# Altium schematic sheet 18_IR_LED.SchDoc
size 420 x 297 mm; SheetNumber: 18; SheetTotal: 27
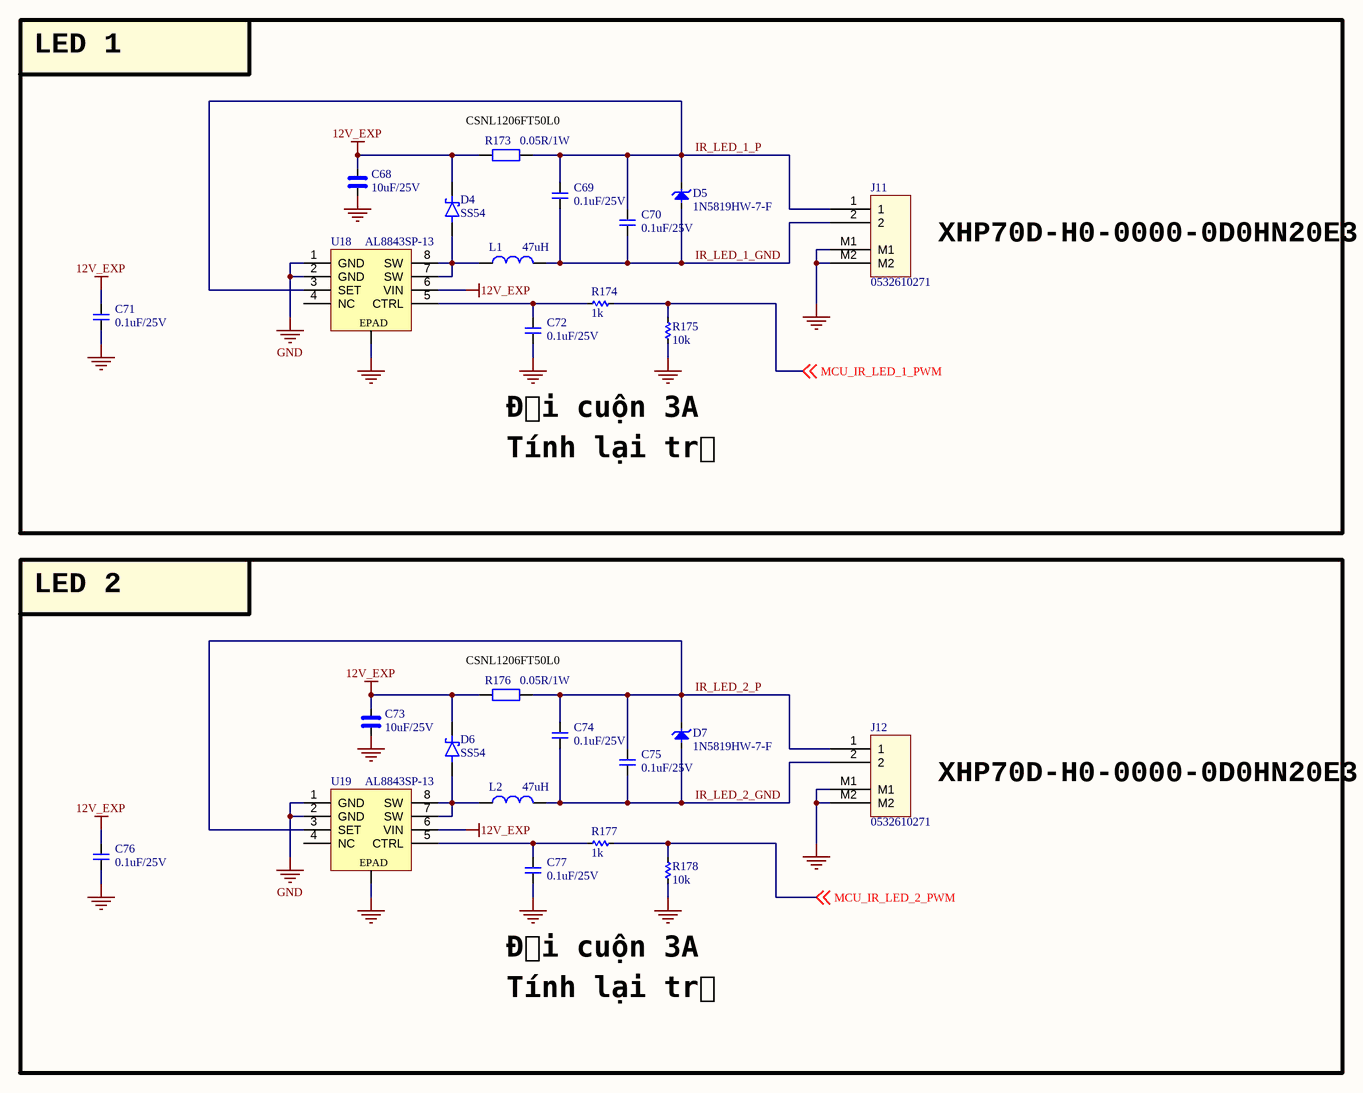
[diagram p0: 18_IR_LED.SchDoc]

## Parts
C68  10uF/25V  [CAP_C_2012X110]
C69  0.1uF/25V  [CAP_C_1608X80]
C70  0.1uF/25V  [CAP_C_1608X80]
C71  0.1uF/25V  [CAP_C_1608X80]
C72  0.1uF/25V  [CAP_C_1608X80]
C73  10uF/25V  [CAP_C_2012X110]
C74  0.1uF/25V  [CAP_C_1608X80]
C75  0.1uF/25V  [CAP_C_1608X80]
C76  0.1uF/25V  [CAP_C_1608X80]
C77  0.1uF/25V  [CAP_C_1608X80]
D4  SS54  [DO-214AC_SMA]
D5  1N5819HW-7-F  [SOD3717X145N]
D6  SS54  [DO-214AC_SMA]
D7  1N5819HW-7-F  [SOD3717X145N]
J11  0532610271  [MOLEX_0532610271]
J12  0532610271  [MOLEX_0532610271]
L1  47uH  [IND_MP_1250x1250x850]
L2  47uH  [IND_MP_1250x1250x850]
R173  0.05R/1W  [RES_C_3216X70]
R174  1k  [RES_C_1608X60]
R175  10k  [RES_C_1608X60]
R176  0.05R/1W  [RES_C_3216X70]
R177  1k  [RES_C_1608X60]
R178  10k  [RES_C_1608X60]
U18  AL8843SP-13  [SOIC127P602X173-8N_EPAD]
U19  AL8843SP-13  [SOIC127P602X173-8N_EPAD]

## Nets
12V_EXP: C68.1 C71.2 C73.1 C76.2 D4.1(K) D6.1(K) R173.1 R176.1 U18.6(VIN) U19.6(VIN)
GND: C68.2 C71.1 C72.1 C73.2 C76.1 C77.1 J11.M1 J11.M2 J12.M1 J12.M2 R175.2 R178.2 U18.1(GND) U18.2(GND) U18.9(EPAD) U19.1(GND) U19.2(GND) U19.9(EPAD)
IR_LED_1_GND: C69.1 C70.1 D5.2(A) J11.2 L1.2
IR_LED_1_P: C69.2 C70.2 D5.1(K) J11.1 R173.2 U18.3(SET)
IR_LED_2_GND: C74.1 C75.1 D7.2(A) J12.2 L2.2
IR_LED_2_P: C74.2 C75.2 D7.1(K) J12.1 R176.2 U19.3(SET)
MCU_IR_LED_1_PWM: R174.2 R175.1 ; off-sheet MCU_IR_LED_1_PWM
MCU_IR_LED_2_PWM: R177.2 R178.1 ; off-sheet MCU_IR_LED_2_PWM
NetC72_2: C72.2 R174.1 U18.5(CTRL)
NetC77_2: C77.2 R177.1 U19.5(CTRL)
NetD4_2: D4.2(A) L1.1 U18.7(SW) U18.8(SW)
NetD6_2: D6.2(A) L2.1 U19.7(SW) U19.8(SW)

Not connected (* = marked no-connect by the designer): U18 4(NC); U19 4(NC)

## Notes on the sheet
- LED 1
- (near R173) CSNL1206FT50L0
- XHP70D-H0-0000-0D0HN20E3
- Đổi cuộn 3A
- Tính lại trở
- LED 2
- (near R176) CSNL1206FT50L0
- Project
- Sub-system:
- Design by:
- Sheet title:
- Sheet:
- of
- Checked by:
- Approved by:
- Doc no:
- Revision
- Size:
- Date:

## Library data of the parts
C68 C73 = _CAP_C_High_2: CAP High Value
C69-C72 C74-C77 = _CAP_C_2: CAP
D4 D6 = DIODE SCHOTTKY
D5 D7 = DIODE Zener: Zenner
J11 J12 = Header 2x1_2M
L1 L2 = L-SMD-1: B82477P4473M000; partNo: 78477010; Manufacturer: Wurth Elektronik; Inductance: 1.0 μH; ComponentLink1Description: Manufacturer; ComponentLink1URL: http://www.we-online.de; Created by: Baojun Chen; Created Date: Nov.2015; ComponentLink2Description: Datasheet; ComponentLink2URL: http://katalog.we-online.de/pbs/datasheet/78477010.pdf
R173 R176 = _RES: RES; Chung_Loai: Dán; Don_Vi: Con; So_Chan: 2; Ten_Linh_Kien: Trở 0603 1% 10k; Ma_Hang: MH006333; Kieu_Chan: *
R174 R175 R177 R178 = _RES_B_2: RES
U18 U19 = AL8843SP-13: IC LED DRIVER RGLTR PWM 3A 8SO